# Altium schematic sheet P08_BNO055 TH.SchDoc
size 246 x 182 mm
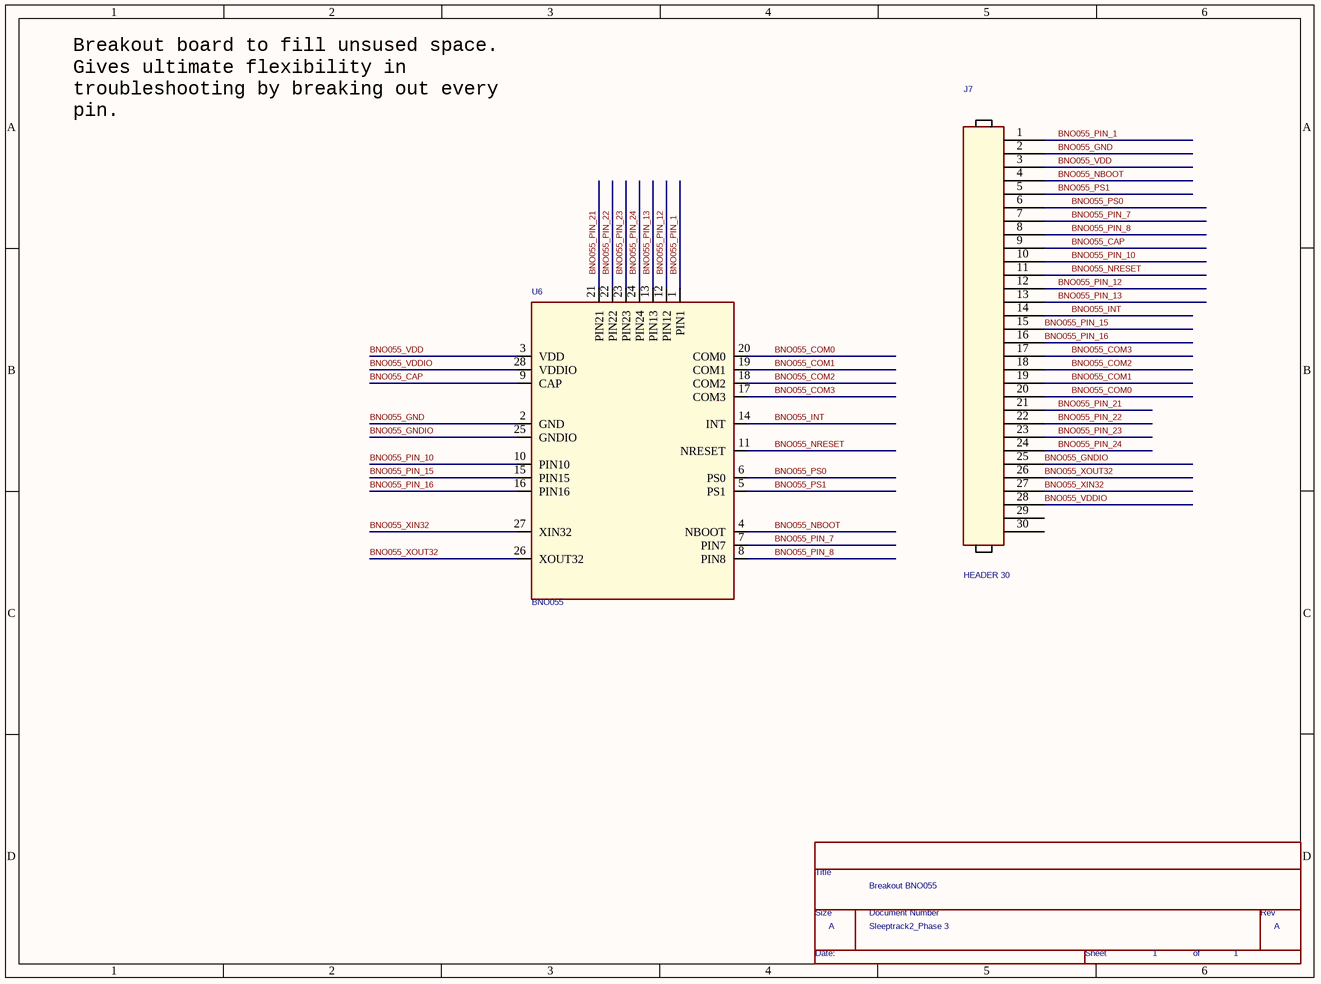
[diagram p0: P08_BNO055 TH.SchDoc]

## Parts
*  Doc: Sleeptrack2_Phase 3  RevCode: A  Title: Breakout BNO055  Page Number: 1  (hidden comment: TitleBlock0)  (graphical)
J7  HEADER 30  [30mini]
U6  BNO055  [bno055]

## Nets
BNO055_CAP: J7.9 U6.9(CAP)
BNO055_COM0: J7.20 U6.20(COM0)
BNO055_COM1: J7.19 U6.19(COM1)
BNO055_COM2: J7.18 U6.18(COM2)
BNO055_COM3: J7.17 U6.17(COM3)
BNO055_GND: J7.2 U6.2(GND)
BNO055_GNDIO: J7.25 U6.25(GNDIO)
BNO055_INT: J7.14 U6.14(INT)
BNO055_NBOOT: J7.4 U6.4(NBOOT)
BNO055_NRESET: J7.11 U6.11(NRESET)
BNO055_PIN_1: J7.1 U6.1(PIN1)
BNO055_PIN_7: J7.7 U6.7(PIN7)
BNO055_PIN_8: J7.8 U6.8(PIN8)
BNO055_PIN_10: J7.10 U6.10(PIN10)
BNO055_PIN_12: J7.12 U6.12(PIN12)
BNO055_PIN_13: J7.13 U6.13(PIN13)
BNO055_PIN_15: J7.15 U6.15(PIN15)
BNO055_PIN_16: J7.16 U6.16(PIN16)
BNO055_PIN_21: J7.21 U6.21(PIN21)
BNO055_PIN_22: J7.22 U6.22(PIN22)
BNO055_PIN_23: J7.23 U6.23(PIN23)
BNO055_PIN_24: J7.24 U6.24(PIN24)
BNO055_PS0: J7.6 U6.6(PS0)
BNO055_PS1: J7.5 U6.5(PS1)
BNO055_VDD: J7.3 U6.3(VDD)
BNO055_VDDIO: J7.28 U6.28(VDDIO)
BNO055_XIN32: J7.27 U6.27(XIN32)
BNO055_XOUT32: J7.26 U6.26(XOUT32)

Not connected (* = marked no-connect by the designer): J7 29 30

## Notes on the sheet
- Breakout board to fill unsused space.
  Gives ultimate flexibility in
  troubleshooting by breaking out every
  pin.
- (in symbol TitleBlock0) Title; Size; Document Number; Rev; Date:; Sheet; of

## Library data of the parts
* = TitleBlock0: Page Create Date: March  8, 1995; Page Size: A; Page Count: 1